# Altium schematic sheet PWM_CONTROLLER.SchDoc: PWM_CONTROLLER
size A
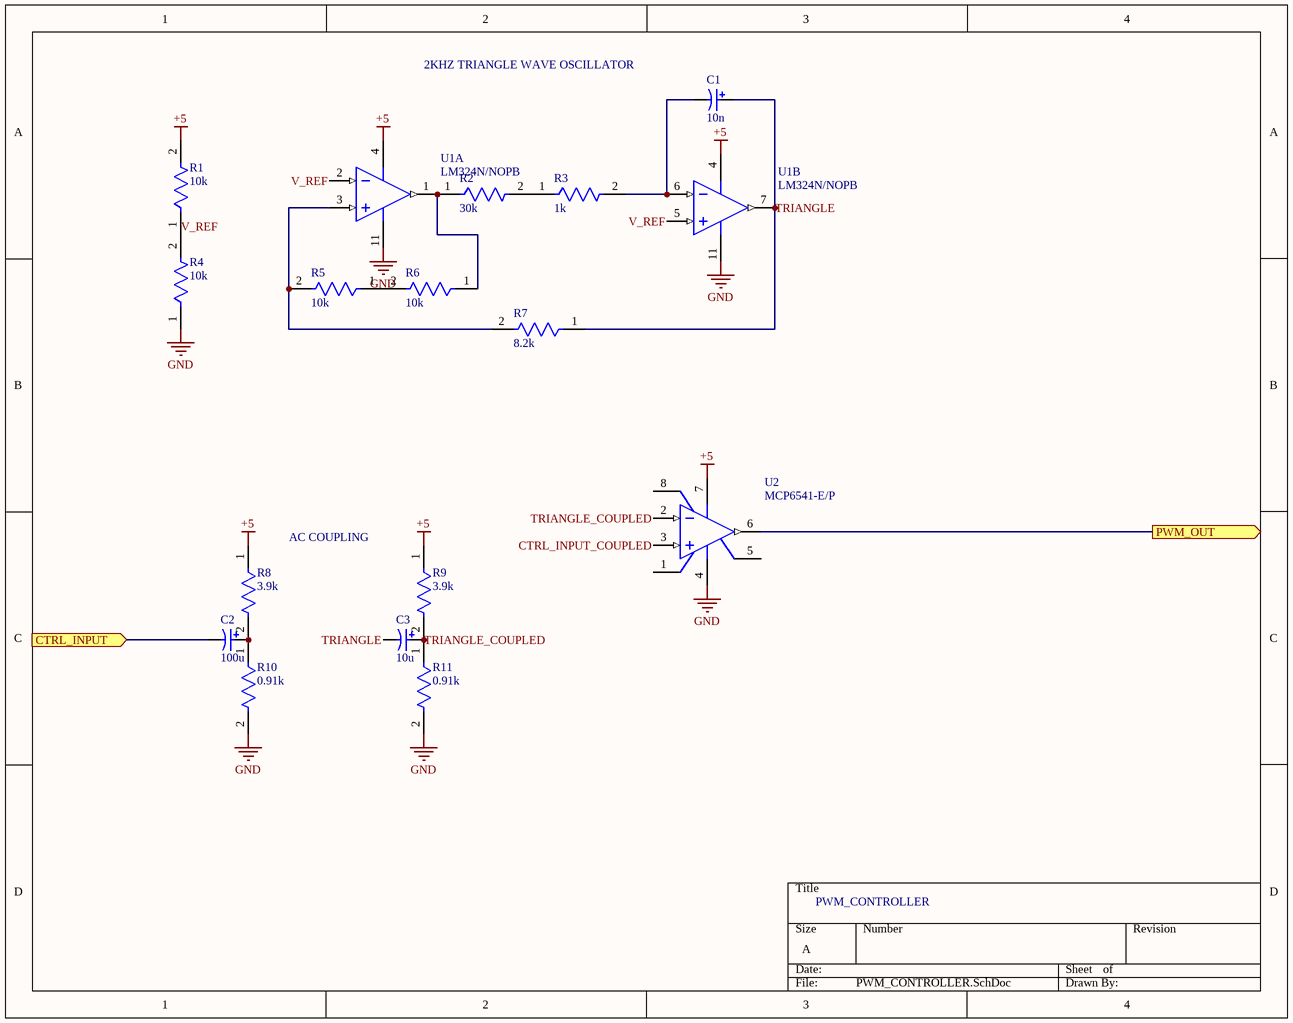
[diagram p0: PWM_CONTROLLER.SchDoc]

## Parts
C1  10n  [PNSC-ECA-1VM221-2]
C2  100u  [PNSC-ECA-1VM221-2]
C3  10u  [PNSC-ECA-1VM221-2]
R1  10k  [FP-CF18-MFG]
R2  30k  [FP-CF18-MFG]
R3  1k  [FP-CF18-MFG]
R4  10k  [FP-CF18-MFG]
R5  10k  [FP-CF18-MFG]
R6  10k  [FP-CF18-MFG]
R7  8.2k  [FP-CF18-MFG]
R8  3.9k  [FP-CF18-MFG]
R9  3.9k  [FP-CF18-MFG]
R10  0.91k  [FP-CF18-MFG]
R11  0.91k  [FP-CF18-MFG]
U1  LM324N/NOPB  [NFF0014A]  (parts A,B of 4)
U2  MCP6541-E/P  [PDIP300-P8]

## Ports
CTRL_INPUT (in), PWM_OUT (out)

## Nets
+5: R1.2 R8.1 R9.1 U1.4(V+) U2.7(VDD)
GND: R4.1 R10.2 R11.2 U1.11(GND) U2.4(VSS)
CTRL_INPUT: C2.2 ; port CTRL_INPUT
CTRL_INPUT_COUPLED: U2.3(VIN+)
PWM_OUT: U2.6(OUT) ; port PWM_OUT
TRIANGLE: C1.1 C3.2 R7.1 U1.7(OUT2)
TRIANGLE_COUPLED: C3.1 R9.2 R11.1 U2.2(VIN-)
V_REF: R1.1 R4.2 U1.2(IN1-) U1.5(IN2+)
NetC1_2: C1.2 R3.2 U1.6(IN2-)
NetC2_1: C2.1 R8.2 R10.1
NetR2_1: R2.1 R6.1 U1.1(OUT1)
NetR2_2: R2.2 R3.1
NetR5_1: R5.1 R6.2
NetR5_2: R5.2 R7.2 U1.3(IN1+)

Not connected (* = marked no-connect by the designer): U2 1(NC) 5(NC) 8(NC)

## Notes on the sheet
- 2KHZ TRIANGLE WAVE OSCILLATOR
- AC COUPLING
- PWM_CONTROLLER

## Library data of the parts
C1-C3 = CMP-2000-05311-1: Aluminum Electrolytic Capacitor, 220 uF, +/- 20%, 35 V, -40 to 85 degC, 2-Pin THD, RoHS, Bulk; Manufacturer: Panasonic; Lifetime@Temperature: 2000Hrs@85degC; Rated Voltage: 35V; Ripple Current: 350mA; Type: Radial; Capacitance: 220µF; Package Reference: ECA-1VM221; Series: M; Operating Temp Range: -40to+85degC; Package Description: 2-Pin Axial Lead, Dia 8 mm, Body Length 12.5 mm; Datasheet Version: Mar-06; Datasheet URL: https://datasheet.ciiva.com/26341/441851-da-01-en-elko-eca1vm221-m-r-220myf-35v-85c-26341906.pdf; Operating Temp-Max: 85degC; Case Size/Dimension: Ø8x11.5mm; Manufacturer URL: http://www.panasonic.com/
R1-R11 = CMP-26528-000001-1: RES 2.2K OHM 1/8W 5% CF AXIAL; Manufacturer: Stackpole Electronics Inc; Manufacturer Part Number: CF18JT2K20; Value: 2.2kΩ; Voltage Rating: 250V; Temperature Coefficient: 0/-400ppm/°C; Power Rating: 0.125W; Composition: Carbon Film; Octopart: https://octopart.com/cf18jt2k20-stackpole+electronics-19205714; Tolerance: 5%; Series: CF; Temperature Range Low: -55°C; ComponentLink2URL: https://www.seielect.com/catalog/sei-cf_cfm.pdf; Ipc Land Pattern Name: RESAD656W65L360D200; Package: CF18; Device Class L2: Resistors; Device Class L3: Through-Hole Resistors; Resistance: 2.2kΩ; Height: 2mm; Category: Res; ComponentLink2Description: Datasheet; Lead Free: Yes; Temperature Range High: +155°C; Temperature: -55°C to +155°C; RoHS: TRUE; Device Class L1: Passive Components; Digikey Description: RES 2.2K OHM 1/8W 5% CF AXIAL; Automotive: No
U1 = CMP-0055-00116-3: Low Power Quad Operational Amplifier, 14-pin MDIP, Pb-Free; Manufacturer: Texas Instruments; PowerWise: N; CompType: Amplifiers; PackageTopMarking: NSUZXYYTTE#*LM324N; RoHS: Y; PinCount: 14; ComponentLink1URL: http://www.ti.com/general/docs/lit/getliterature.tsp?genericPartNumber=LM324-N&fileType=pdf; ComponentLink1Description: Datasheet URL; PackageDescription: MDIP, .750 x .250 x.130in, 14 Lead, .100in Pitch; Code_JEDEC: MS-001-AA; Package Reference: NFF0014A
U2 = CMP-0187-00117-2: Push-Pull Output Sub-Microamp Comparator, 8-Pin PDIP, Extended Temperature; PackageReference: PDIP300-P8; DatasheetVersion: revH, Dec-2011; ComponentLink3Description: Package Specification; Code_JEDEC: MS-001; PackageVersion: revBB, Aug-2009; ComponentLink2URL: http://ww1.microchip.com/downloads/en/DeviceDoc/21696H.pdf; ComponentLink3URL: http://www.microchip.com/stellent/groups/techpub_sg/documents/packagingspec/en012702.pdf; ComponentLink2Description: Datasheet; PackageDescription: 8-Lead Plastic Dual In-Line (P) - 300 mil Body [PDIP]; ComponentLink1URL: http://www.microchip.com/; ComponentLink1Description: Manufacturer URL; RevisionNote: URLs added. DatasheetVersion updated.